# Altium schematic sheet Stackup.SchDoc
size Letter; SheetNumber: 6; SheetTotal: 6
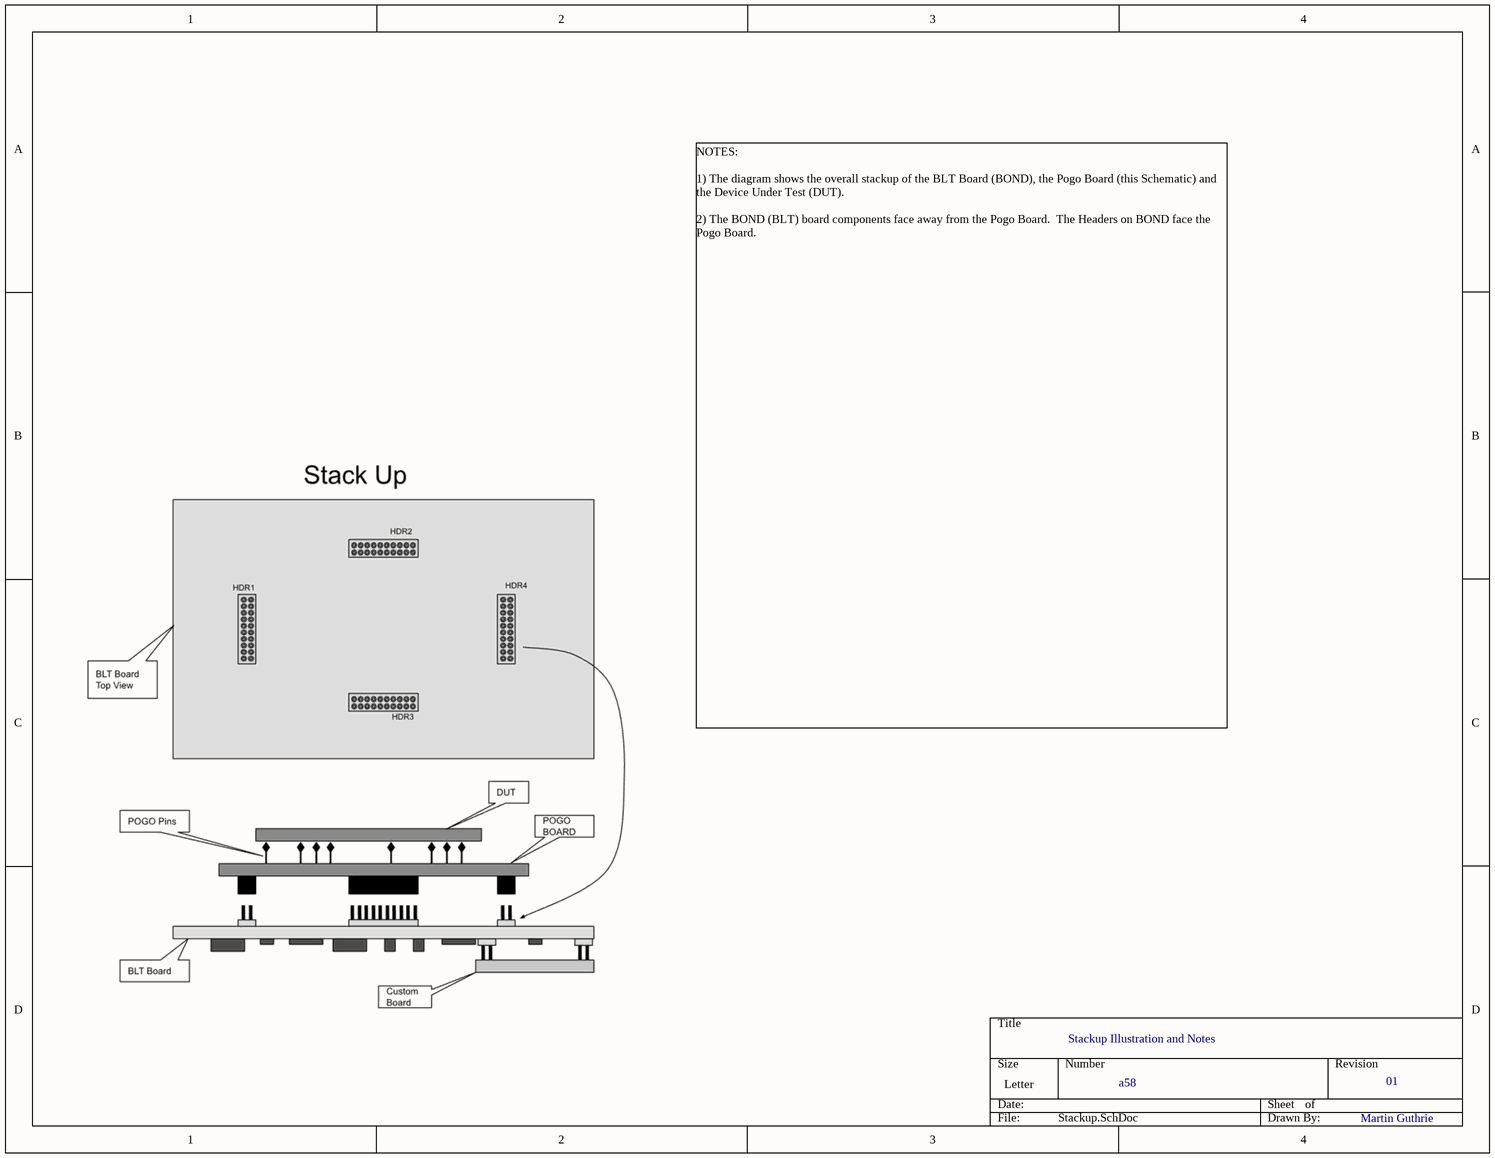
[diagram p0: Stackup.SchDoc]

## Notes on the sheet
- NOTES:
  1) The diagram shows the overall stackup of the BLT Board (BOND), the Pogo Board (this Schematic) and the Device Under Test (DUT).
  2) The BOND (BLT) board components face away from the Pogo Board.  The Headers on BOND face the Pogo Board.
- Stackup Illustration and Notes
- a58
- 01
- Martin Guthrie